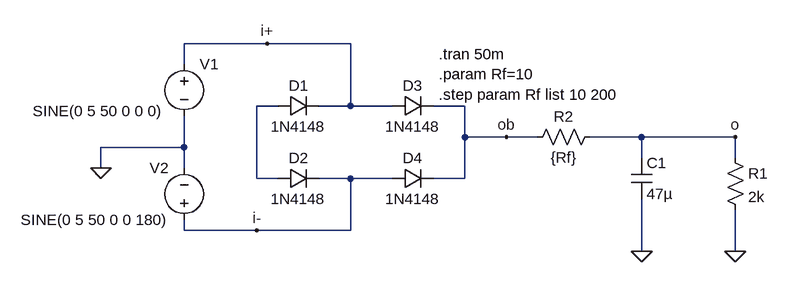
[diagram p0: schematic fig1b.asc]
fig1b.asc, the LTspice schematic file:
Version 4
SHEET 1 1048 680
WIRE 272 16 144 16
WIRE 400 16 272 16
WIRE 144 48 144 16
WIRE 288 112 256 112
WIRE 400 112 400 16
WIRE 400 112 352 112
WIRE 464 112 400 112
WIRE 576 112 528 112
WIRE 576 160 576 112
WIRE 640 160 576 160
WIRE 688 160 640 160
WIRE 848 160 768 160
WIRE 992 160 848 160
WIRE 144 176 144 128
WIRE 144 176 16 176
WIRE 848 192 848 160
WIRE 992 192 992 160
WIRE 16 208 16 176
WIRE 144 208 144 176
WIRE 256 224 256 112
WIRE 288 224 256 224
WIRE 400 224 352 224
WIRE 464 224 400 224
WIRE 576 224 576 160
WIRE 576 224 528 224
WIRE 144 304 144 288
WIRE 256 304 144 304
WIRE 400 304 400 224
WIRE 400 304 256 304
WIRE 848 336 848 256
WIRE 992 336 992 272
FLAG 16 208 0
FLAG 992 336 0
FLAG 256 304 i-
FLAG 272 16 i+
FLAG 992 160 o
FLAG 848 336 0
FLAG 640 160 ob
SYMBOL voltage 144 32 R0
WINDOW 3 -233 88 Left 2
WINDOW 123 0 0 Left 0
WINDOW 39 0 0 Left 0
SYMATTR InstName V1
SYMATTR Value SINE(0 5 50 0 0 0)
SYMBOL voltage 144 304 R180
WINDOW 0 24 96 Left 2
WINDOW 3 24 16 Left 2
WINDOW 123 0 0 Left 0
WINDOW 39 0 0 Left 0
SYMATTR InstName V2
SYMATTR Value SINE(0 5 50 0 0 180)
SYMBOL diode 288 128 R270
WINDOW 0 32 32 VTop 2
WINDOW 3 0 32 VBottom 2
SYMATTR InstName D1
SYMATTR Value 1N4148
SYMBOL diode 288 240 R270
WINDOW 0 32 32 VTop 2
WINDOW 3 0 32 VBottom 2
SYMATTR InstName D2
SYMATTR Value 1N4148
SYMBOL diode 464 128 R270
WINDOW 0 32 32 VTop 2
WINDOW 3 0 32 VBottom 2
SYMATTR InstName D3
SYMATTR Value 1N4148
SYMBOL diode 464 240 R270
WINDOW 0 32 32 VTop 2
WINDOW 3 0 32 VBottom 2
SYMATTR InstName D4
SYMATTR Value 1N4148
SYMBOL res 976 176 R0
SYMATTR InstName R1
SYMATTR Value 2k
SYMBOL res 784 144 R90
WINDOW 0 0 56 VBottom 2
WINDOW 3 32 56 VTop 2
SYMATTR InstName R2
SYMATTR Value {Rf}
SYMBOL cap 832 192 R0
SYMATTR InstName C1
SYMATTR Value 47µ
TEXT 536 32 Left 2 !.tran 50m\n.param Rf=10\n.step param Rf list 10 200

The netlist it stands for:
* fig1b.asc
V1 i+ 0 SINE(0 5 50 0 0 0)
V2 i- 0 SINE(0 5 50 0 0 180)
D1 N001 i+ 1N4148
D2 N001 i- 1N4148
D3 i+ ob 1N4148
D4 i- ob 1N4148
R1 o 0 2k
R2 o ob {Rf}
C1 o 0 47µ
.model D D
.lib standard.dio
.tran 50m
.param Rf=10
.step param Rf list 10 200
.backanno
.end

* Results of the author's LTspice run, read from the files saved beside the schematic
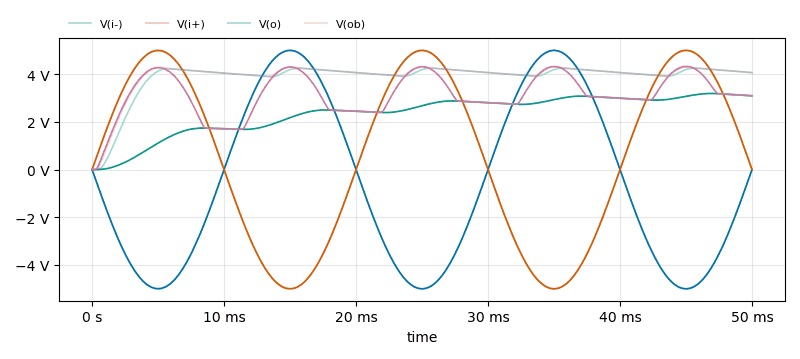
[diagram p1: Transient Analysis of fig1b.asc, plotted from the saved traces]
* Transient Analysis, 2 runs:
*   V(i-) [run 1]: min -5 V, max 5 V, average -636.1 mV, rms 3.537 V, last 0 V
*   V(i-) [run 2]: min -5 V, max 5 V, average -636.2 mV, rms 3.536 V, last 0 V
*   V(i+) [run 1]: min -5 V, max 5 V, average 636.1 mV, rms 3.537 V, last 0 V
*   V(i+) [run 2]: min -5 V, max 5 V, average 636.2 mV, rms 3.536 V, last 0 V
*   V(o) [run 1]: min 0 V, max 4.253 V, average 3.887 V, rms 3.963 V, last 4.068 V
*   V(o) [run 2]: min 0 V, max 3.192 V, average 2.345 V, rms 2.486 V, last 3.096 V
*   V(ob) [run 1]: min 0 V, max 4.306 V, average 3.945 V, rms 4.005 V, last 4.068 V
*   V(ob) [run 2]: min 0 V, max 4.327 V, average 3.16 V, rms 3.278 V, last 3.096 V